# EAGLE schematic locux sodimm (EAGLE 6.1)
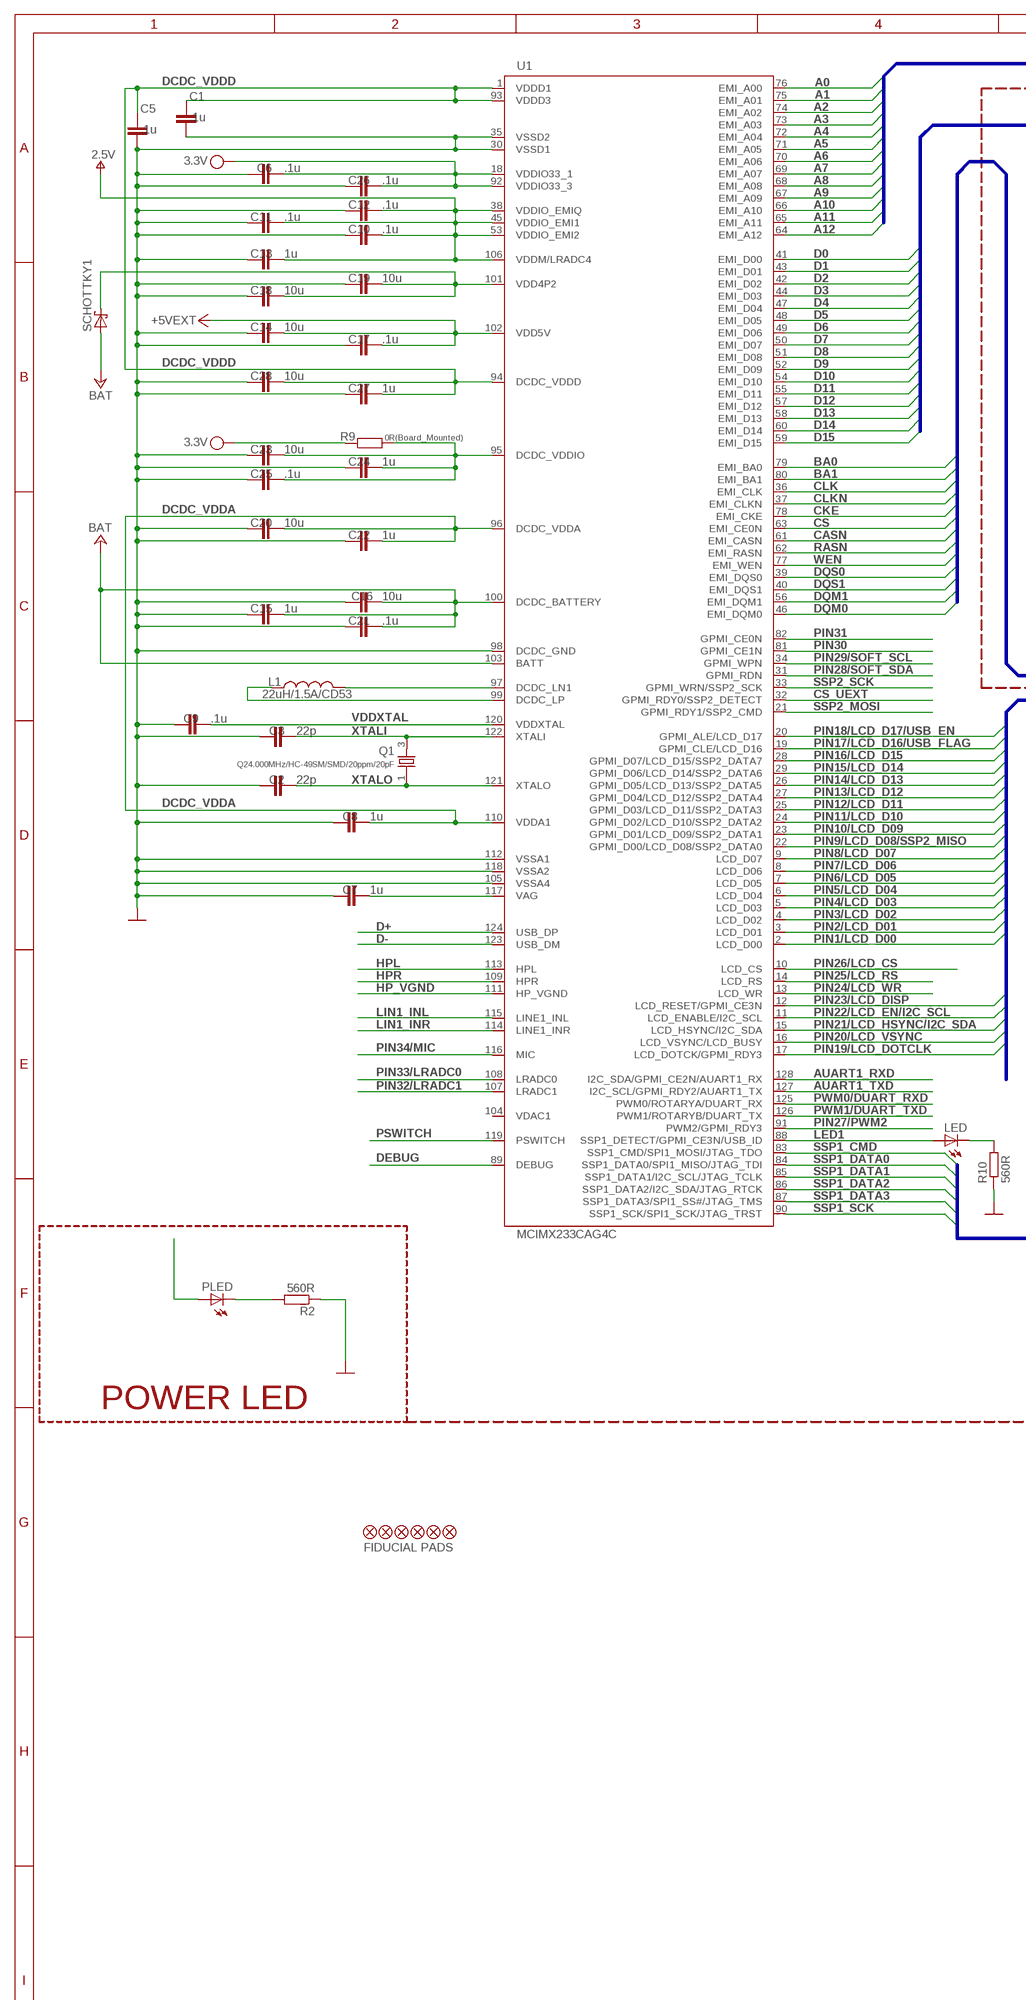
[diagram p0: schematic, sheet 1, part 1 of 2]
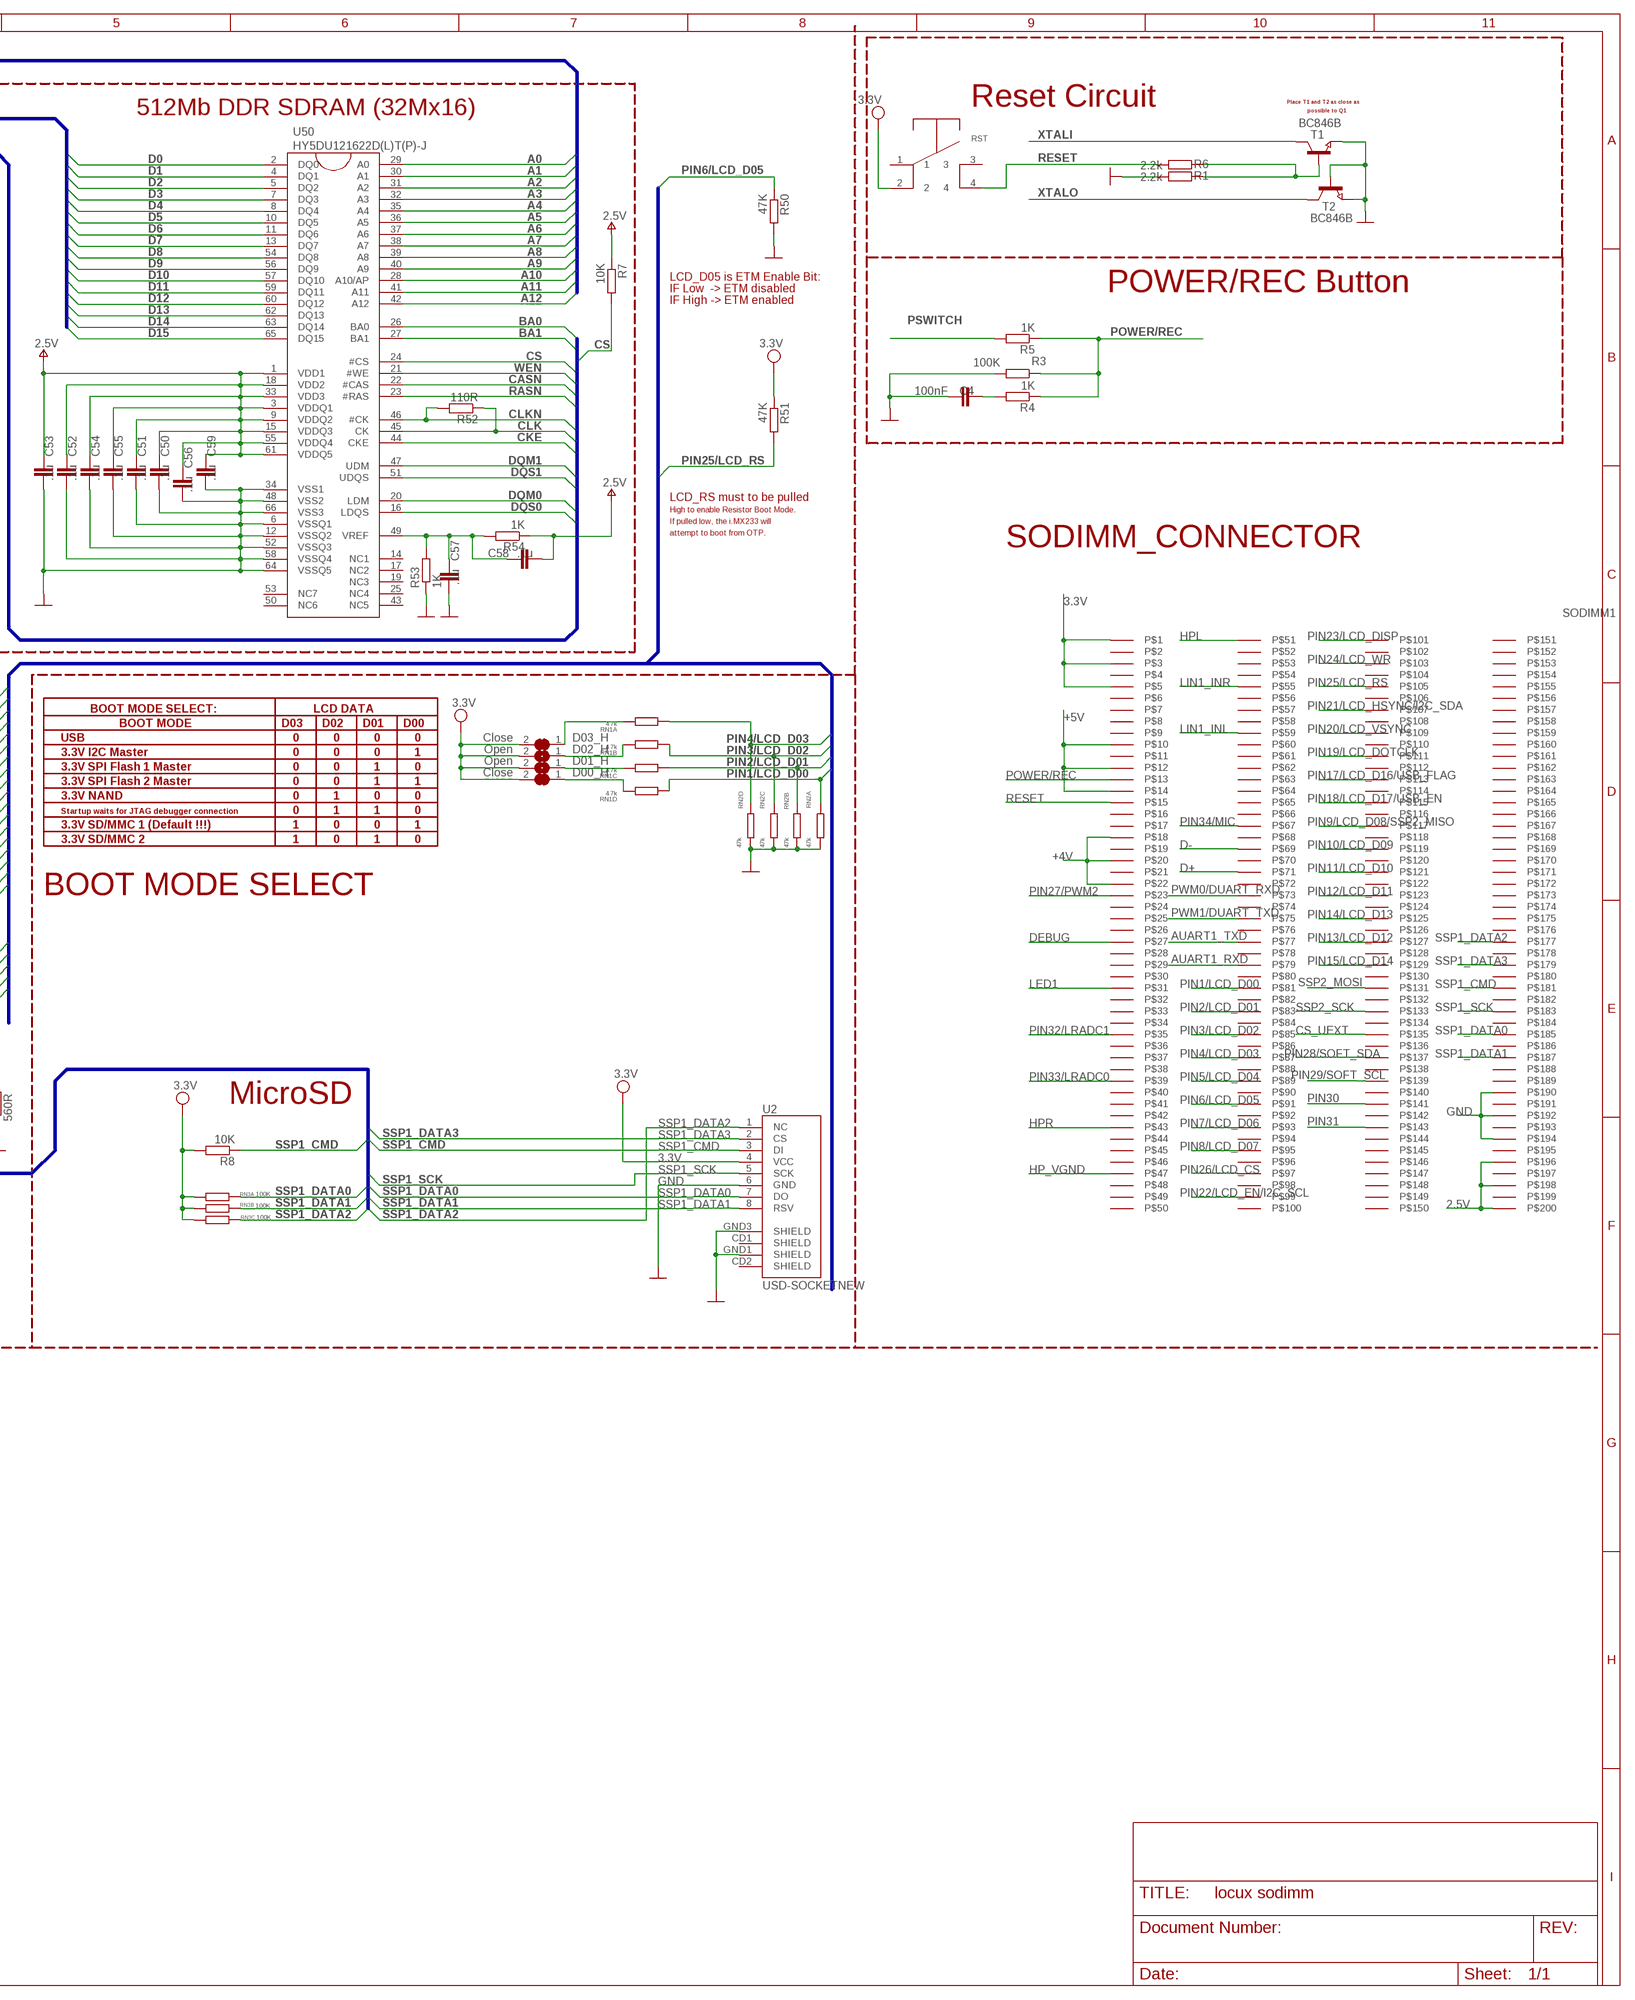
[diagram p1: schematic, sheet 1, part 2 of 2]

## Parts
C1  .1u  CAPACITOR_0603  [C0603]
C2  22p  CAPACITOR_0603  [C0603]
C3  22p  CAPACITOR_0603  [C0603]
C4  100nF  CAPACITOR_0603  [C0603]
C5  .1u  CAPACITOR_0603  [C0603]
C6  .1u  CAPACITOR_0603  [C0603]
C7  1u  CAPACITOR_0603  [C0603]
C8  1u  CAPACITOR_0603  [C0603]
C9  .1u  CAPACITOR_0603  [C0603]
C10  .1u  CAPACITOR_0603  [C0603]
C11  .1u  CAPACITOR_0603  [C0603]
C12  .1u  CAPACITOR_0603  [C0603]
C13  1u  CAPACITOR_0603  [C0603]
C14  10u  CAPACITOR_0603  [C0603]
C15  1u  CAPACITOR_0603  [C0603]
C16  10u  CAPACITOR_0603  [C0603]
C17  .1u  CAPACITOR_0603  [C0603]
C18  10u  CAPACITOR_0603  [C0603]
C19  10u  CAPACITOR_0603  [C0603]
C20  10u  CAPACITOR_0603  [C0603]
C21  .1u  CAPACITOR_0603  [C0603]
C22  1u  CAPACITOR_0603  [C0603]
C23  10u  CAPACITOR_0603  [C0603]
C24  1u  CAPACITOR_0603  [C0603]
C25  .1u  CAPACITOR_0603  [C0603]
C26  .1u  CAPACITOR_0603  [C0603]
C27  1u  CAPACITOR_0603  [C0603]
C28  10u  CAPACITOR_0603  [C0603]
C50  .1u  CAPACITOR_0603  [C0603]
C51  .1u  CAPACITOR_0603  [C0603]
C52  .1u  CAPACITOR_0603  [C0603]
C53  .1u  CAPACITOR_0603  [C0603]
C54  .1u  CAPACITOR_0603  [C0603]
C55  .1u  CAPACITOR_0603  [C0603]
C56  .1u  CAPACITOR_0603  [C0603]
C57  .1u  CAPACITOR_0603  [C0603]
C58  .1u  CAPACITOR_0603  [C0603]
C59  .1u  CAPACITOR_0603  [C0603]
D00_H  Close  SJSJ_SMALLER  [SJ_1_SMALLER]
D01_H  Open  SJSJ_SMALLER  [SJ_1_SMALLER]
D02_H  Open  SJSJ_SMALLER  [SJ_1_SMALLER]
D03_H  Close  SJSJ_SMALLER  [SJ_1_SMALLER]
JP1  FIDUCIAL1.5X3  [FIDUCIAL-1.5X3]
JP2  FIDUCIAL1.5X3  [FIDUCIAL-1.5X3]
JP3  FIDUCIAL1.5X3  [FIDUCIAL-1.5X3]
JP50  FIDUCIAL1.5X3  [FIDUCIAL-1.5X3]
JP51  FIDUCIAL1.5X3  [FIDUCIAL-1.5X3]
JP52  FIDUCIAL1.5X3  [FIDUCIAL-1.5X3]
L1  22uH/1.5A/CD53  INDUCTORNPI75  [NPI75C]
LED  LEDCHIP-LED0603  [CHIP-LED0603]
PLED  LEDCHIP-LED0603  [CHIP-LED0603]
Q1  Q24.000MHz/HC-49SM/SMD/20ppm/20pF  CRYSTAL4PIN  [CRYSTAL-4PIN]
R1  2.2k  RESISTOR_0603  [R0603]
R2  560R  RESISTOR_0603  [R0603]
R3  100K  RESISTOR_0603  [R0603]
R4  1K  RESISTOR_0603  [R0603]
R5  1K  RESISTOR_0603  [R0603]
R6  2.2k  RESISTOR_0603  [R0603]
R7  10K  RESISTOR_0603  [R0603]
R8  10K  RESISTOR_0603  [R0603]
R9  0R(Board_Mounted)  RESISTOR_0603  [R0603]
R10  560R  RESISTOR_0603  [R0603]
R50  47K  RESISTOR_0603  [R0603]
R51  47K  RESISTOR_0603  [R0603]
R52  110R  RESISTOR_0603  [R0603]
R53  1K  RESISTOR_0603  [R0603]
R54  1K  RESISTOR_0603  [R0603]
RN1  4.7k  4R-N  [0603-ARC]
RN2  47k  4R-N  [0603-ARC]
RN3  100K  4R-N  [0603-ARC]
RST  SWITCH_MOMENTARY  [SWITCH_SMD]
SCHOTTKY1  SCHOTTKY-DIODESMA2  [SCHOTTKY_SMA]
SODIMM1  SODIMM_BOARDSMALL  [SODIMM_BOARD_SMALLER]
T1  BC846B  NPN-TRANSISTOR_SOT23  [SOT23]
T2  BC846B  NPN-TRANSISTOR_SOT23  [SOT23]
U1  MCIMX233CAG4C  MCIMX233DAG4B_LD  [TQFP128LD]
U2  USD-SOCKETNEW  [MICRO-SD-SOCKET-PP]
U50  HY5DU121622D(L)T(P)-J  [66TSOP-II]

## Nets
2.5V: C10.2 C11.2 C12.2 C13.2 C50.2 C51.2 C52.2 C53.2 C54.2 C55.2 C56.2 C58.1 C59.2 R7.1 R54.1 SODIMM1.196 SODIMM1.198 SODIMM1.200 U1.38(VDDIO_EMIQ) U1.45(VDDIO_EMI1) U1.53(VDDIO_EMI2) U1.106(VDDM/LRADC4) U50.1(VDD1) U50.3(VDDQ1) U50.9(VDDQ2) U50.15(VDDQ3) U50.18(VDD2) U50.33(VDD3) U50.55(VDDQ4) U50.61(VDDQ5)
3.3V [pwr]: C6.2 C26.2 D00_H.2 D01_H.2 D02_H.2 D03_H.2 PLED.A R8.2 R9.1 R51.1 RN3.1 RN3.2 RN3.3 RST.2 SODIMM1.1 SODIMM1.3 SODIMM1.5 U1.18(VDDIO33_1) U1.92(VDDIO33_3) U2.4(VCC)
+4V: C15.2 C16.2 C21.2 SCHOTTKY1.A SODIMM1.18 SODIMM1.20 SODIMM1.22 U1.100(DCDC_BATTERY) U1.103(BATT) ; supply symbol labelled BAT
+5V: C14.2 C17.2 SODIMM1.10 SODIMM1.12 SODIMM1.14 U1.102(VDD5V) ; supply symbol labelled +5VEXT
A0: U1.76(EMI_A00) U50.29(A0)
A1: U1.75(EMI_A01) U50.30(A1)
A2: U1.74(EMI_A02) U50.31(A2)
A3: U1.73(EMI_A03) U50.32(A3)
A4: U1.72(EMI_A04) U50.35(A4)
A5: U1.71(EMI_A05) U50.36(A5)
A6: U1.70(EMI_A06) U50.37(A6)
A7: U1.69(EMI_A07) U50.38(A7)
A8: U1.68(EMI_A08) U50.39(A8)
A9: U1.67(EMI_A09) U50.40(A9)
A10: U1.66(EMI_A10) U50.28(A10/AP)
A11: U1.65(EMI_A11) U50.41(A11)
A12: U1.64(EMI_A12) U50.42(A12)
AUART1_RXD: SODIMM1.79 U1.128(I2C_SDA/GPMI_CE2N/AUART1_RX)
AUART1_TXD: SODIMM1.77 U1.127(I2C_SCL/GPMI_RDY2/AUART1_TX)
BA0: U1.79(EMI_BA0) U50.26(BA0)
BA1: U1.80(EMI_BA1) U50.27(BA1)
CASN: U1.61(EMI_CASN) U50.22(#CAS)
CKE: U1.78(EMI_CKE) U50.44(CKE)
CLK: R52.1 U1.36(EMI_CLK) U50.45(CK)
CLKN: R52.2 U1.37(EMI_CLKN) U50.46(#CK)
CS: R7.2 U1.63(EMI_CE0N) U50.24(#CS)
CS_UEXT: SODIMM1.135 U1.32(GPMI_RDY0/SSP2_DETECT)
D0: U1.41(EMI_D00) U50.2(DQ0)
D1: U1.43(EMI_D01) U50.4(DQ1)
D2: U1.42(EMI_D02) U50.5(DQ2)
D3: U1.44(EMI_D03) U50.7(DQ3)
D4: U1.47(EMI_D04) U50.8(DQ4)
D5: U1.48(EMI_D05) U50.10(DQ5)
D6: U1.49(EMI_D06) U50.11(DQ6)
D7: U1.50(EMI_D07) U50.13(DQ7)
D8: U1.51(EMI_D08) U50.54(DQ8)
D9: U1.52(EMI_D09) U50.56(DQ9)
D10: U1.54(EMI_D10) U50.57(DQ10)
D11: U1.55(EMI_D11) U50.59(DQ11)
D12: U1.57(EMI_D12) U50.60(DQ12)
D13: U1.58(EMI_D13) U50.62(DQ13)
D14: U1.60(EMI_D14) U50.63(DQ14)
D15: U1.59(EMI_D15) U50.65(DQ15)
D+: SODIMM1.71 U1.124(USB_DP)
D-: SODIMM1.69 U1.123(USB_DM)
DCDC_VDDA: C8.2 C20.2 C22.2 U1.96(DCDC_VDDA) U1.110(VDDA1)
DCDC_VDDD: C1.2 C5.2 C27.2 C28.2 U1.1(VDDD1) U1.93(VDDD3) U1.94(DCDC_VDDD)
DCDC_VDDIO: C23.2 C24.2 C25.2 R9.2 U1.95(DCDC_VDDIO)
DEBUG: SODIMM1.27 U1.89(DEBUG)
DQM0: U1.46(EMI_DQM0) U50.20(LDM)
DQM1: U1.56(EMI_DQM1) U50.47(UDM)
DQS0: U1.39(EMI_DQS0) U50.16(LDQS)
DQS1: U1.40(EMI_DQS1) U50.51(UDQS)
GND [pwr]: C1.1 C2.1 C3.1 C4.2 C5.1 C6.1 C7.1 C8.1 C9.1 C10.1 C11.1 C12.1 C13.1 C14.1 C15.1 C16.1 C17.1 C18.1 C19.1 C20.1 C21.1 C22.1 C23.1 C24.1 C25.1 C26.1 C27.1 C28.1 C50.1 C51.1 C52.1 C53.1 C54.1 C55.1 C56.1 C57.1 C59.1 R1.2 R2.1 R3.2 R10.1 R50.2 R53.1 RN2.5 RN2.6 RN2.7 RN2.8 SODIMM1.190 SODIMM1.192 SODIMM1.194 T1.2(E) T2.1(B) T2.2(E) U1.30(VSSD1) U1.35(VSSD2) U1.98(DCDC_GND) U1.105(VSSA4) U1.112(VSSA1) U1.118(VSSA2) U2.6(GND) U2.GND1(SHIELD) U2.GND3(SHIELD) U50.6(VSSQ1) U50.12(VSSQ2) U50.34(VSS1) U50.48(VSS2) U50.52(VSSQ3) U50.58(VSSQ4) U50.64(VSSQ5) U50.66(VSS3)
HP_VGND: SODIMM1.47 U1.111(HP_VGND)
HPL: SODIMM1.51 U1.113(HPL)
HPR: SODIMM1.43 U1.109(HPR)
LED1: LED.A SODIMM1.31 U1.88(SSP1_DETECT/GPMI_CE3N/USB_ID)
LIN1_INL: SODIMM1.59 U1.115(LINE1_INL)
LIN1_INR: SODIMM1.55 U1.114(LINE1_INR)
N$1: D03_H.1 RN1.8
N$3: LED.C R10.2
N$4: PLED.C R2.2
N$7: C57.2 C58.2 R53.2 R54.2 U50.49(VREF)
N$18: L1.2 U1.97(DCDC_LN1)
N$19: L1.1 U1.99(DCDC_LP)
N$25: C7.2 U1.117(VAG)
N$38: C4.1 R4.2
N$43: R1.1 R6.1 T1.1(B)
N$103: D02_H.1 RN1.7
N$104: D01_H.1 RN1.6
N$105: D00_H.1 RN1.5
PIN1/LCD_D00: RN1.4 RN2.1 SODIMM1.81 U1.2(LCD_D00)
PIN2/LCD_D01: RN1.3 RN2.2 SODIMM1.83 U1.3(LCD_D01)
PIN3/LCD_D02: RN1.2 RN2.3 SODIMM1.85 U1.4(LCD_D02)
PIN4/LCD_D03: RN1.1 RN2.4 SODIMM1.87 U1.5(LCD_D03)
PIN5/LCD_D04: SODIMM1.89 U1.6(LCD_D04)
PIN6/LCD_D05: R50.1 SODIMM1.91 U1.7(LCD_D05)
PIN7/LCD_D06: SODIMM1.93 U1.8(LCD_D06)
PIN8/LCD_D07: SODIMM1.95 U1.9(LCD_D07)
PIN9/LCD_D08/SSP2_MISO: SODIMM1.117 U1.22(GPMI_D00/LCD_D08/SSP2_DATA0)
PIN10/LCD_D09: SODIMM1.119 U1.23(GPMI_D01/LCD_D09/SSP2_DATA1)
PIN11/LCD_D10: SODIMM1.121 U1.24(GPMI_D02/LCD_D10/SSP2_DATA2)
PIN12/LCD_D11: SODIMM1.123 U1.25(GPMI_D03/LCD_D11/SSP2_DATA3)
PIN13/LCD_D12: SODIMM1.127 U1.27(GPMI_D04/LCD_D12/SSP2_DATA4)
PIN14/LCD_D13: SODIMM1.125 U1.26(GPMI_D05/LCD_D13/SSP2_DATA5)
PIN15/LCD_D14: SODIMM1.129 U1.29(GPMI_D06/LCD_D14/SSP2_DATA6)
PIN16/LCD_D15: U1.28(GPMI_D07/LCD_D15/SSP2_DATA7)
PIN17/LCD_D16/USB_FLAG: SODIMM1.113 U1.19(GPMI_CLE/LCD_D16)
PIN18/LCD_D17/USB_EN: SODIMM1.115 U1.20(GPMI_ALE/LCD_D17)
PIN19/LCD_DOTCLK: SODIMM1.111 U1.17(LCD_DOTCK/GPMI_RDY3)
PIN20/LCD_VSYNC: SODIMM1.109 U1.16(LCD_VSYNC/LCD_BUSY)
PIN21/LCD_HSYNC/I2C_SDA: SODIMM1.107 U1.15(LCD_HSYNC/I2C_SDA)
PIN22/LCD_EN/I2C_SCL: SODIMM1.99 U1.11(LCD_ENABLE/I2C_SCL)
PIN23/LCD_DISP: SODIMM1.101 U1.12(LCD_RESET/GPMI_CE3N)
PIN24/LCD_WR: SODIMM1.103 U1.13(LCD_WR)
PIN25/LCD_RS: R51.2 SODIMM1.105 U1.14(LCD_RS)
PIN26/LCD_CS: SODIMM1.97 U1.10(LCD_CS)
PIN27/PWM2: SODIMM1.23 U1.91(PWM2/GPMI_RDY3)
PIN28/SOFT_SDA: SODIMM1.133 U1.31(GPMI_RDN)
PIN29/SOFT_SCL: SODIMM1.139 U1.34(GPMI_WPN)
PIN30: SODIMM1.141 U1.81(GPMI_CE1N)
PIN31: SODIMM1.143 U1.82(GPMI_CE0N)
PIN32/LRADC1: SODIMM1.35 U1.107(LRADC1)
PIN33/LRADC0: SODIMM1.39 U1.108(LRADC0)
PIN34/MIC: SODIMM1.67 U1.116(MIC)
POWER/REC: R3.1 R4.1 R5.1 SODIMM1.13
PSWITCH: R5.2 U1.119(PSWITCH)
PWM0/DUART_RXD: SODIMM1.73 U1.125(PWM0/ROTARYA/DUART_RX)
PWM1/DUART_TXD: SODIMM1.75 U1.126(PWM1/ROTARYB/DUART_TX)
RASN: U1.62(EMI_RASN) U50.23(#RAS)
RESET: R6.2 RST.4 SODIMM1.15
SSP1_CMD: R8.1 SODIMM1.181 U1.83(SSP1_CMD/SPI1_MOSI/JTAG_TDO) U2.3(DI)
SSP1_DATA0: RN3.8 SODIMM1.185 U1.84(SSP1_DATA0/SPI1_MISO/JTAG_TDI) U2.7(DO)
SSP1_DATA1: RN3.7 SODIMM1.187 U1.85(SSP1_DATA1/I2C_SCL/JTAG_TCLK) U2.8(RSV)
SSP1_DATA2: RN3.6 SODIMM1.177 U1.86(SSP1_DATA2/I2C_SDA/JTAG_RTCK) U2.1(NC)
SSP1_DATA3: SODIMM1.179 U1.87(SSP1_DATA3/SPI1_SS#/JTAG_TMS) U2.2(CS)
SSP1_SCK: SODIMM1.183 U1.90(SSP1_SCK/SPI1_SCK/JTAG_TRST) U2.5(SCK)
SSP2_MOSI: SODIMM1.131 U1.21(GPMI_RDY1/SSP2_CMD)
SSP2_SCK: SODIMM1.137 U1.33(GPMI_WRN/SSP2_SCK)
VDD4P2: C18.2 C19.2 SCHOTTKY1.C U1.101(VDD4P2)
VDDXTAL: C9.2 U1.120(VDDXTAL)
WEN: U1.77(EMI_WEN) U50.21(#WE)
XTALI: C3.2 Q1.3 T1.3(C) U1.122(XTALI)
XTALO: C2.2 Q1.1 T2.3(C) U1.121(XTALO)
Unconnected: RN3.4 RN3.5 RST.1 RST.3 SODIMM1.2 SODIMM1.4 SODIMM1.6 SODIMM1.7 SODIMM1.8 SODIMM1.9 SODIMM1.11 SODIMM1.16 SODIMM1.17 SODIMM1.19 SODIMM1.21 SODIMM1.24 SODIMM1.25 SODIMM1.26 SODIMM1.28 SODIMM1.29 SODIMM1.30 SODIMM1.32 SODIMM1.33 SODIMM1.34 SODIMM1.36 SODIMM1.37 SODIMM1.38 SODIMM1.40 SODIMM1.41 SODIMM1.42 SODIMM1.44 SODIMM1.45 SODIMM1.46 SODIMM1.48 SODIMM1.49 SODIMM1.50 SODIMM1.52 SODIMM1.53 SODIMM1.54 SODIMM1.56 SODIMM1.57 SODIMM1.58 SODIMM1.60 SODIMM1.61 SODIMM1.62 SODIMM1.63 SODIMM1.64 SODIMM1.65 SODIMM1.66 SODIMM1.68 SODIMM1.70 SODIMM1.72 SODIMM1.74 SODIMM1.76 SODIMM1.78 SODIMM1.80 SODIMM1.82 SODIMM1.84 SODIMM1.86 SODIMM1.88 SODIMM1.90 SODIMM1.92 SODIMM1.94 SODIMM1.96 SODIMM1.98 SODIMM1.100 SODIMM1.102 SODIMM1.104 SODIMM1.106 SODIMM1.108 SODIMM1.110 SODIMM1.112 SODIMM1.114 SODIMM1.116 SODIMM1.118 SODIMM1.120 SODIMM1.122 SODIMM1.124 SODIMM1.126 SODIMM1.128 SODIMM1.130 SODIMM1.132 SODIMM1.134 SODIMM1.136 SODIMM1.138 SODIMM1.140 SODIMM1.142 SODIMM1.144 SODIMM1.145 SODIMM1.146 SODIMM1.147 SODIMM1.148 SODIMM1.149 SODIMM1.150 SODIMM1.151 SODIMM1.152 SODIMM1.153 SODIMM1.154 SODIMM1.155 SODIMM1.156 SODIMM1.157 SODIMM1.158 SODIMM1.159 SODIMM1.160 SODIMM1.161 SODIMM1.162 SODIMM1.163 SODIMM1.164 SODIMM1.165 SODIMM1.166 SODIMM1.167 SODIMM1.168 SODIMM1.169 SODIMM1.170 SODIMM1.171 SODIMM1.172 SODIMM1.173 SODIMM1.174 SODIMM1.175 SODIMM1.176 SODIMM1.178 SODIMM1.180 SODIMM1.182 SODIMM1.184 SODIMM1.186 SODIMM1.188 SODIMM1.189 SODIMM1.191 SODIMM1.193 SODIMM1.195 SODIMM1.197 SODIMM1.199 U1.104(VDAC1) U2.CD1(SHIELD) U2.CD2(SHIELD) U50.14(NC1) U50.17(NC2) U50.19(NC3) U50.25(NC4) U50.43(NC5) U50.50(NC6) U50.53(NC7)

## Buses
A[0..12]
D[0..15]
SSP1_CMD/SPI1_MOSI,SSP1_DATA0/SPI1_MISO,SSP1_SCK/SPI1_SCK,SSP1_DATA3/SPI1_SS#,SSP1_DATA1/I2C_SCL,SSP1_DATA2/I2C_SDA
LCD_D17,LCD_D16,LCD_D15,LCD_D14,LCD_D13,LCD_D12,LCD_D11,LCD_D10,LCD_D09,LCD_D08/SSP2_MISO,LCD_D07,LCD_D06,LCD_D05,LCD_D04,LCD_D03,LCD_D02,LCD_D01,LCD_D00,LCD_DOTCLK,LCD_VSYNC,LCD_HSYNC/I2C_SDA,LCD_EN/I2C_SCL,LCD_DISP
BA[0..1],CLK,CLKN,CKE,CS,CASN,RASN,WEN,DQM[0..1],DQS[0..1]

## Notes on the sheet
- Place T1 and T2 as close as
- Reset Circuit
- possible to Q1
- 512Mb DDR SDRAM (32Mx16)
- LCD_D05 is ETM Enable Bit:
- IF Low  -> ETM disabled | POWER/REC Button
- IF High -> ETM enabled
- LCD_RS must to be pulled
- High to enable Resistor Boot Mode.
- If pulled low, the i.MX233 will
- attempt to boot from OTP.
- SODIMM_CONNECTOR
- BOOT MODE SELECT: | LCD DATA
- BOOT MODE | D03 | D02 | D01 | D00
- USB | 0 | 0 | 0 | 0
- 3.3V I2C Master | 0 | 0 | 0 | 1
- 3.3V SPI Flash 1 Master | 0 | 0 | 1 | 0
- 3.3V SPI Flash 2 Master | 0 | 0 | 1 | 1
- 3.3V NAND | 0 | 1 | 0 | 0
- Startup waits for JTAG debugger connection | 0 | 1 | 1 | 0
- 3.3V SD/MMC 1 (Default !!!) | 1 | 0 | 0 | 1
- 3.3V SD/MMC 2 | 1 | 0 | 1 | 0
- BOOT MODE SELECT
- MicroSD
- POWER LED
- FIDUCIAL PADS

## Library data of the parts
C1-C28 C50-C59 = BaseApp:CAPACITOR_0603
D00_H D01_H D02_H D03_H = jumper:SJ: SMD solder JUMPER
JP1-JP3 JP50-JP52 = SparkFun:FIDUCIAL: Fiducial Alignment Points Various fiducial points for machine vision alignment.
L1 = SparkFun:INDUCTOR: Inductors Basic Inductor/Choke - 0603 and 1206. Footprints are not proven and vary greatly between part numbers.
LED PLED = led:LED: LED OSRAM: - CHIPLED LG R971, LG N971, LY N971, LG Q971, LY Q971, LO R971, LY R971 LH N974, LH R974 LS Q976, LO Q976, LY Q976 LO Q996 - Hyper CHIPLED LW Q18S LB Q993, LB Q99A, LB R99A - SideLED LS A670, LO A670, LY A670, LG A670, LP A670 LB A673, LV A673, LT A673, LW A673 LH A674 LY A675 LS A676, LA A676, LO A676, LY A676, LW A676 LS A679, LY A679, LG A679 - Hyper Micro SIDELED® LS Y876, LA Y876, LO Y876, LY Y876 LT Y87S - SmartLED LW L88C, LW L88S LB L89C, LB L89S, LG L890 LS L89K, LO L89K, LY L89K LS L896, LA L896, LO L896, LY L896 - TOPLED LS T670, LO T670, LY T670, LG T670, LP T670 LSG T670, LSP T670, LSY T670, LOP T670, LYG T670 LG T671, LOG T671, LSG T671 LB T673, LV T673, LT T673, LW T673 LH T674 LS T676, LA T676, LO T676, LY T676, LB T676, LH T676, LSB T676, LW T676 LB T67C, LV T67C, LT T67C, LS T67K, LO T67K, LY T67K, LW E67C LS E67B, LA E67B, LO E67B, LY E67B, LB E67C, LV E67C, LT E67C LW T67C LS T679, LY T679, LG T679 LS T770, LO T770, LY T770, LG T770, LP T770 LB T773, LV T773, LT T773, LW T773 LH T774 LS E675, LA E675, LY E675, LS T675 LS T776, LA T776, LO T776, LY T776, LB T776 LHGB T686 LT T68C, LB T68C - Hyper Mini TOPLED® LB M676 - Mini TOPLED Santana® LG M470 LS M47K, LO M47K, LY M47K Source: http://www.osram.convergy.de LUXEON: - LUMILED® LXK2-PW12-R00, LXK2-PW12-S00, LXK2-PW14-U00, LXK2-PW14-V00 LXK2-PM12-R00, LXK2-PM12-S00, LXK2-PM14-U00 LXK2-PE12-Q00, LXK2-PE12-R00, LXK2-PE12-S00, LXK2-PE14-T00, LXK2-PE14-U00 LXK2-PB12-K00, LXK2-PB12-L00, LXK2-PB12-M00, LXK2-PB14-N00, LXK2-PB14-P00, LXK2-PB14-Q00 LXK2-PR12-L00, LXK2-PR12-M00, LXK2-PR14-Q00, LXK2-PR14-R00 LXK2-PD12-Q00, LXK2-PD12-R00, LXK2-PD12-S00 LXK2-PH12-R00, LXK2-PH12-S00 LXK2-PL12-P00, LXK2-PL12-Q00, LXK2-PL12-R00 Source: www.luxeon.com KINGBRIGHT: KA-3528ASYC Source: www.kingbright.com
Q1 = BaseApp:CRYSTAL: CRYSTAL SMD-10.5X4.8-2PIN :- http://www.digikey.com/product-detail/en/CX49GFNB12000H0PESZZ/478-4349-1-ND/1532102 SMD-5X3- 4PIN :- http://www.digikey.com/product-detail/en/ABM3C-12.000MHZ-D4Y-T/535-11281-1-ND/2639912
R1-R10 R50-R54 = BaseApp:RESISTOR_0603: Resistance Package :- 0603 Mount :-Surface mount
RN1-RN3 = BaseApp:4R-N
RST = BaseApp:SWITCH_MOMENTARY: Soft Switch http://www.digikey.com/product-detail/en/EVQ-Q2B03W/P12932SCT-ND/762922
SCHOTTKY1 = BaseApp:SCHOTTKY-DIODE
SODIMM1 = BaseApp:SODIMM_BOARD: SODIMM BOARD Thickness of board must be 1mm.
T1 T2 = semicon-smd-ipc:NPN-TRANSISTOR_: NPN TRANSISTOR
U1 = OLIMEX_IC:MCIMX233DAG4B: i.MX23
U2 = SparkFun:USD-SOCKET: microSD Socket Push-push type uSD socket. Schematic element and footprint production proven. Spark Fun Electronics SKU : PRT-00127. tDoc lines correctly indicate media card edge positions when inserting (unlocked, locked, depressed).
U50 = OLIMEX_IC:HY5DU121622D(L)T(P)

## Net classes
1 pwr: width 0.15 mm, clearance 0.15 mm